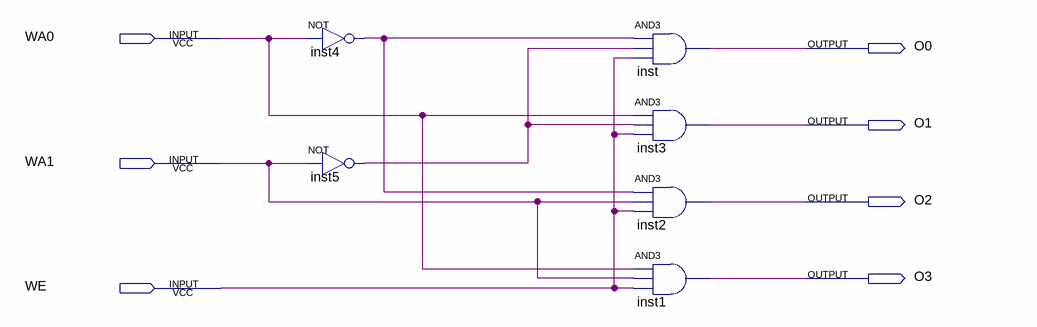
[diagram p0: schematic sheet]
// Quartus schematic DEC24D.bdf as structural Verilog: 6 symbols, 7 pins
module DEC24D (
  input  WA0,
  input  WA1,
  input  WE,
  output O0,
  output O1,
  output O2,
  output O3
);

  wire inst4_out, inst5_out;

  not inst4 (inst4_out, WA0);
  not inst5 (inst5_out, WA1);
  and inst (O0, inst4_out, inst5_out, WE);
  and inst3 (O1, WA0, inst5_out, WE);
  and inst2 (O2, inst4_out, WA1, WE);
  and inst1 (O3, WA0, WA1, WE);
endmodule
